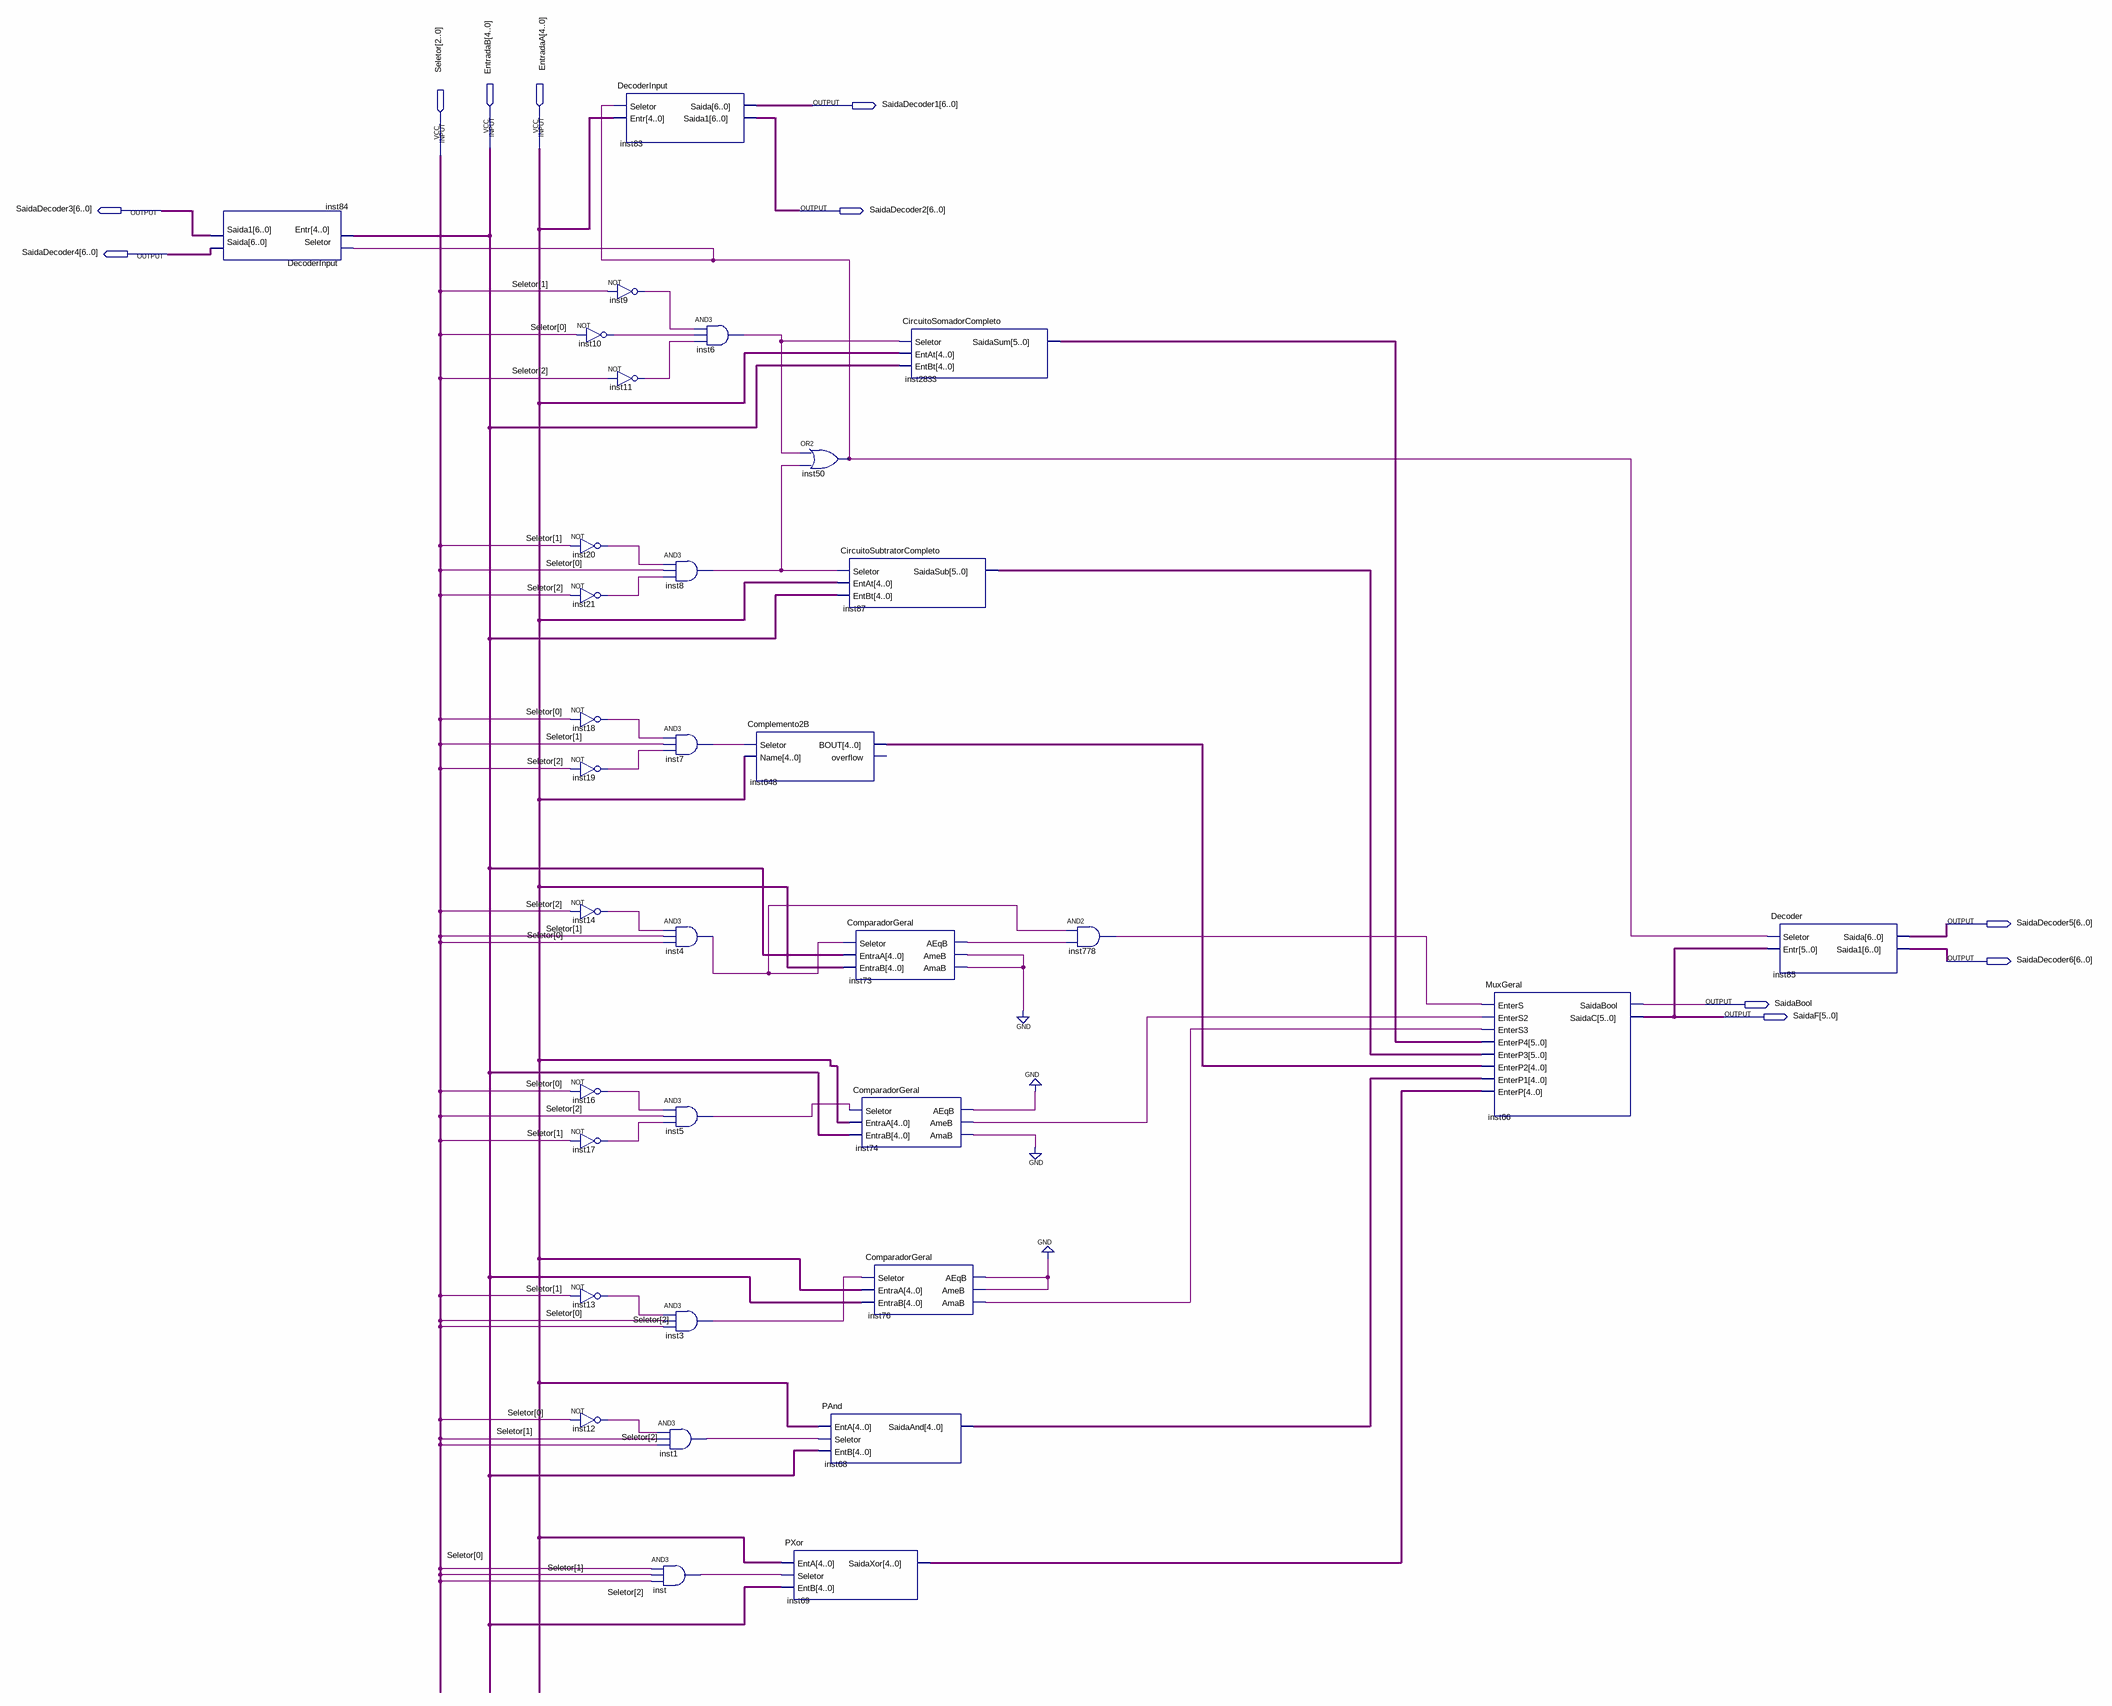
[diagram p0: schematic sheet]
// Quartus schematic ULA.bdf as structural Verilog: 34 symbols, 11 pins
module ULA (
  input  [4:0] EntradaB,
  input  [4:0] EntradaA,
  input  [2:0] Seletor,
  output [6:0] SaidaDecoder1,
  output [6:0] SaidaDecoder3,
  output [6:0] SaidaDecoder2,
  output [6:0] SaidaDecoder4,
  output [6:0] SaidaDecoder5,
  output [6:0] SaidaDecoder6,
  output SaidaBool,
  output [5:0] SaidaF
);

  wire inst1_out, inst3_out, inst4_out, inst5_out, inst6_out, inst7_out, inst8_out, inst9_out, inst10_out,
       inst11_out, inst12_out, inst13_out, inst14_out, inst16_out, inst17_out, inst18_out, inst19_out,
       inst20_out, inst21_out, inst50_out, inst73_aeqb, inst73_ameb, inst74_aeqb, inst74_amab, inst74_ameb,
       inst76_aeqb, inst76_amab, inst778_out, inst_out;
  wire [4:0] inst68_saidaand, inst69_saidaxor, inst648_bout;
  wire [5:0] inst87_saidasub, inst2833_saidasum;

  DecoderInput inst84 (.Seletor(inst50_out), .Entr(EntradaB), .Saida(SaidaDecoder4), .Saida1(SaidaDecoder3));
  not inst20 (inst20_out, Seletor[1]);
  not inst21 (inst21_out, Seletor[2]);
  not inst18 (inst18_out, Seletor[0]);
  not inst19 (inst19_out, Seletor[2]);
  not inst14 (inst14_out, Seletor[2]);
  not inst16 (inst16_out, Seletor[0]);
  not inst17 (inst17_out, Seletor[1]);
  not inst13 (inst13_out, Seletor[1]);
  not inst12 (inst12_out, Seletor[0]);
  DecoderInput inst83 (.Seletor(inst50_out), .Entr(EntradaA), .Saida(SaidaDecoder1), .Saida1(SaidaDecoder2));
  not inst9 (inst9_out, Seletor[1]);
  not inst10 (inst10_out, Seletor[0]);
  not inst11 (inst11_out, Seletor[2]);
  and inst8 (inst8_out, inst20_out, Seletor[0], inst21_out);
  and inst7 (inst7_out, inst18_out, Seletor[1], inst19_out);
  and inst4 (inst4_out, inst14_out, Seletor[1], Seletor[0]);
  and inst5 (inst5_out, inst16_out, Seletor[2], inst17_out);
  and inst3 (inst3_out, inst13_out, Seletor[0], Seletor[2]);
  and inst1 (inst1_out, inst12_out, Seletor[1], Seletor[2]);
  and inst (inst_out, Seletor[0], Seletor[1], Seletor[2]);
  and inst6 (inst6_out, inst9_out, inst10_out, inst11_out);
  Complemento2B inst648 (.Seletor(inst7_out), .Name(EntradaA), .BOUT(inst648_bout));  // open: overflow
  or inst50 (inst50_out, inst6_out, inst8_out);
  PAnd inst68 (.EntA(EntradaA), .Seletor(inst1_out), .EntB(EntradaB), .SaidaAnd(inst68_saidaand));
  PXor inst69 (.EntA(EntradaA), .Seletor(inst_out), .EntB(EntradaB), .SaidaXor(inst69_saidaxor));
  CircuitoSubtratorCompleto inst87 (
    .Seletor(inst8_out), .EntAt(EntradaA), .EntBt(EntradaB), .SaidaSub(inst87_saidasub));
  ComparadorGeral inst73 (
    .Seletor(inst4_out), .EntraA(EntradaB), .EntraB(EntradaA), .AEqB(inst73_aeqb), .AmeB(inst73_ameb),
    .AmaB(inst73_ameb));
  ComparadorGeral inst74 (
    .Seletor(inst5_out), .EntraA(EntradaA), .EntraB(EntradaB), .AEqB(inst74_aeqb), .AmeB(inst74_ameb),
    .AmaB(inst74_amab));
  ComparadorGeral inst76 (
    .Seletor(inst3_out), .EntraA(EntradaA), .EntraB(EntradaB), .AEqB(inst76_aeqb), .AmeB(inst76_aeqb),
    .AmaB(inst76_amab));
  CircuitoSomadorCompleto inst2833 (
    .Seletor(inst6_out), .EntAt(EntradaA), .EntBt(EntradaB), .SaidaSum(inst2833_saidasum));
  and inst778 (inst778_out, inst4_out, inst73_aeqb);
  MuxGeral inst66 (
    .EnterS(inst778_out), .EnterS2(inst74_ameb), .EnterS3(inst76_amab), .EnterP4(inst2833_saidasum),
    .EnterP3(inst87_saidasub), .EnterP2(inst648_bout), .EnterP1(inst68_saidaand), .EnterP(inst69_saidaxor),
    .SaidaBool(SaidaBool), .SaidaC(SaidaF));
  Decoder inst85 (.Seletor(inst50_out), .Entr(SaidaF), .Saida(SaidaDecoder5), .Saida1(SaidaDecoder6));
  // also tied to GND on the sheet: {inst73_ameb, inst74_amab, inst74_aeqb, inst76_aeqb}
endmodule
